# Altium schematic sheet PE43711.SchDoc
size A4
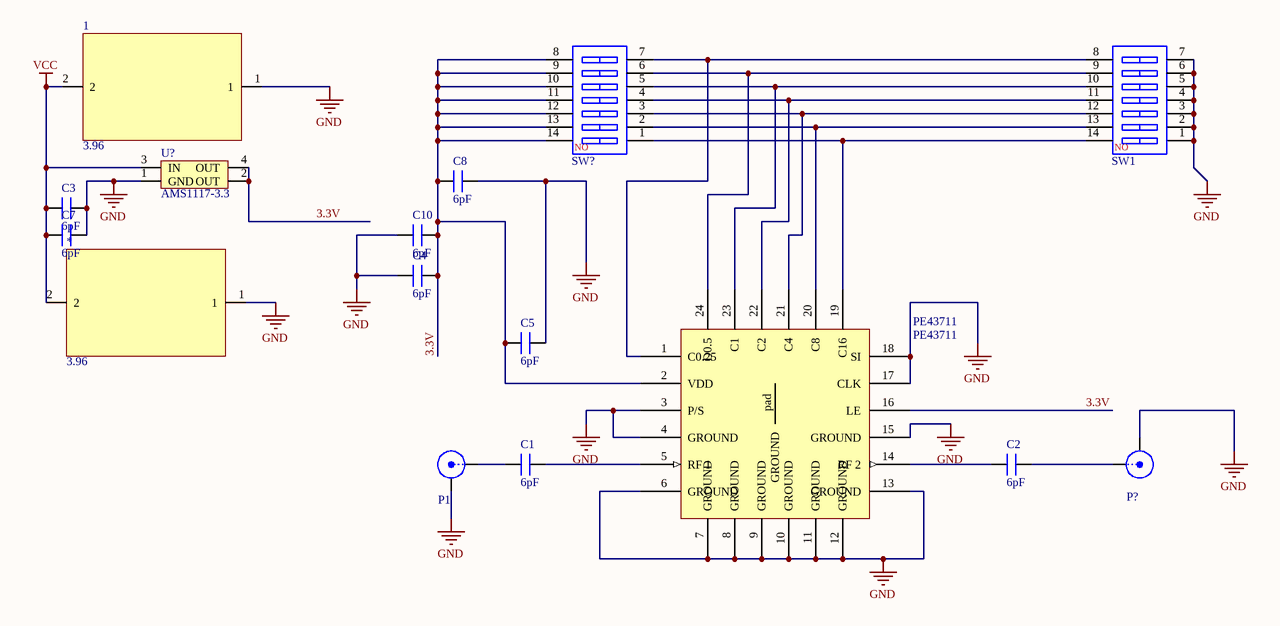
[diagram p0: PE43711.SchDoc]

## Parts
1  3.96  [3.96]
*  3.96  [3.96]
C1  6pF  [0603C]
C2  6pF  [0603C]
C3  6pF  [0603C]
C4  6pF  [1206C]
C5  6pF  [0603C]
C7  6pF  [1206C]
C8  6pF  [0603C]
C10  6pF  [0603C]
P1  SMA  [SMA]  (value not drawn)
P?  SMA  [SMA]  (value not drawn)
PE43711  PE43711  [PE43711]
SW1  CSW-7P  [CSW DIP-7P]  (value not drawn)
SW?  CSW-7P  [CSW DIP-7P_G]  (value not drawn)
U?  AMS1117-3.3  [AMS1117]

## Nets
GND: 1.1 *.1 C3.2 C4.1 C5.2 C7.2 C8.2 C10.1 P1.2(Y) P?.2(Y) PE43711.3(P/S) PE43711.4(GROUND) PE43711.6(GROUND) PE43711.7(GROUND) PE43711.8(GROUND) PE43711.9(GROUND) PE43711.10(GROUND) PE43711.11(GROUND) PE43711.12(GROUND) PE43711.13(GROUND) PE43711.15(GROUND) PE43711.17(CLK) PE43711.18(SI) SW1.1 SW1.2 SW1.3 SW1.4 SW1.5 SW1.6 SW1.7 U?.1(GND)
VCC: 1.2 *.2 C3.1 C7.1 U?.3(IN)
3.3V: C4.2 C5.1 C8.1 C10.2 PE43711.2(VDD) PE43711.16(LE) SW?.8 SW?.9 SW?.10 SW?.11 SW?.12 SW?.13 SW?.14 U?.2(OUT) U?.4(OUT)
NetC1_1: C1.1 P1.1(X)
NetC1_2: C1.2 PE43711.5(RF_1)
NetC2_1: C2.1 PE43711.14(RF_2)
NetC2_2: C2.2 P?.1(X)
NetPE43711_1: PE43711.1(C0.25) SW1.8 SW?.7
NetPE43711_19: PE43711.19(C16) SW1.14 SW?.1
NetPE43711_20: PE43711.20(C8) SW1.13 SW?.2
NetPE43711_21: PE43711.21(C4) SW1.12 SW?.3
NetPE43711_22: PE43711.22(C2) SW1.11 SW?.4
NetPE43711_23: PE43711.23(C1) SW1.10 SW?.5
NetPE43711_24: PE43711.24(D0.5) SW1.9 SW?.6

Not connected (* = marked no-connect by the designer): PE43711 pad(GROUND)

## Notes on the sheet
- (in symbol CSW-7P) NO

## Library data of the parts
C1-C5 C7 C8 C10 = C: Capacitor
P1 P? = SMA: SMA Connector
SW1 SW? = CSW-7P: 7路编码开关; 版权归属: 源创客; BOM名称: 7路编码开关; 学习资源: www.ooocke.com
U? = AMS1117